# EAGLE schematic display_device (EAGLE 8.3.2)
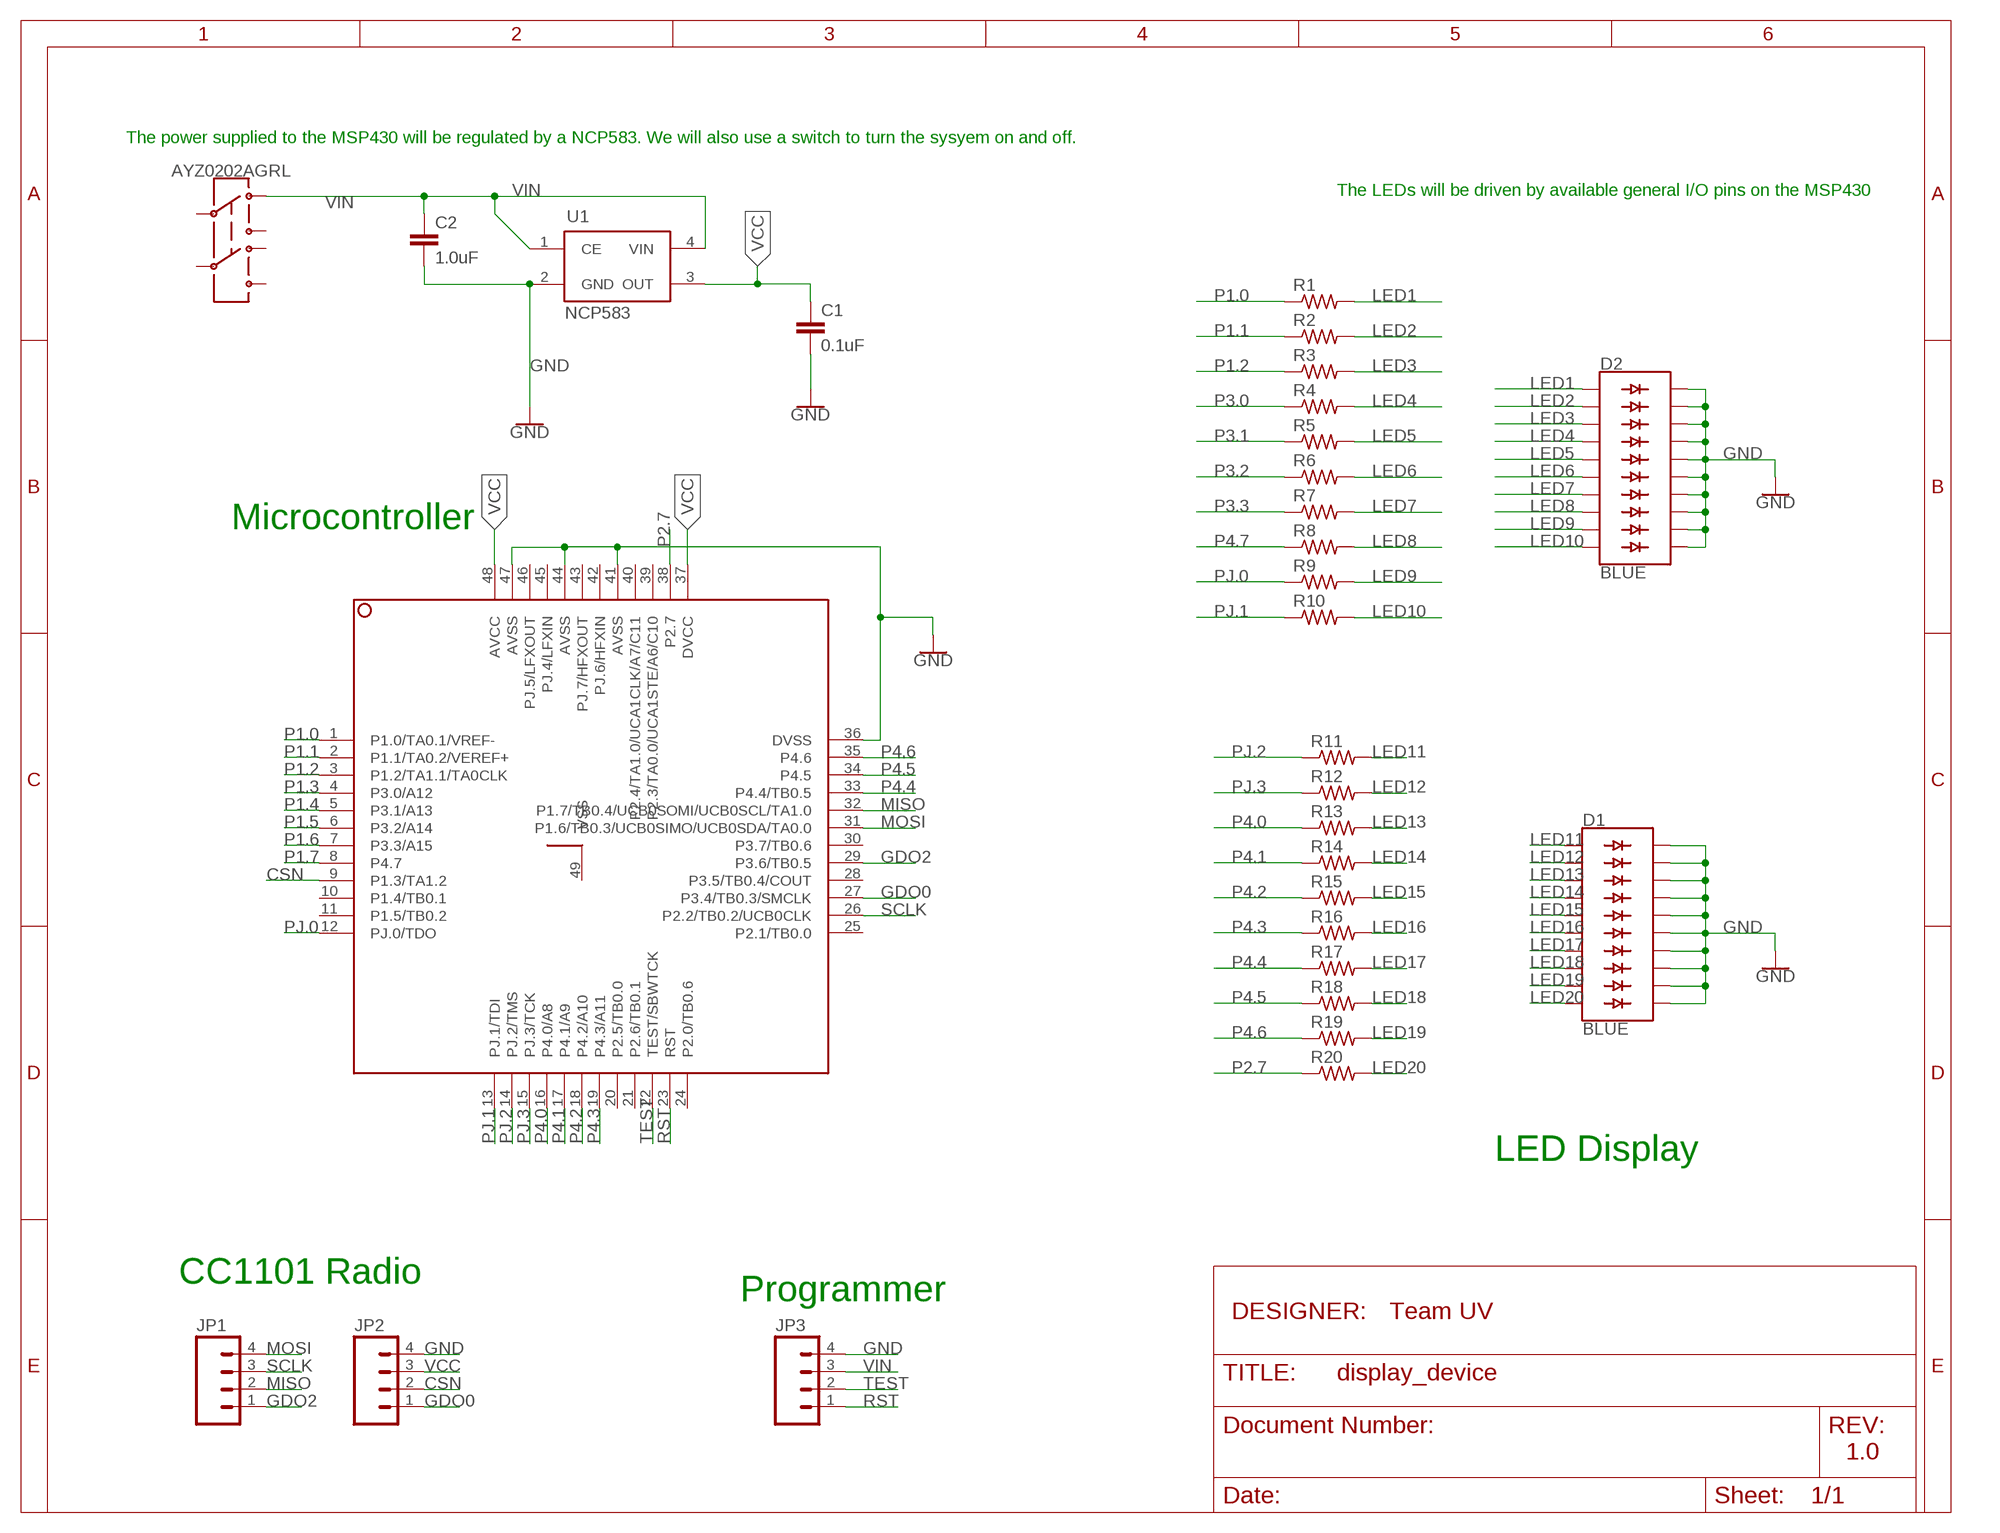
[diagram p0: schematic, sheet 1]

## Parts
AYZ0202AGRL  SWITCH-DPDT-SMD-AYZ0202  [SWITCH_DPDT_SMD_AYZ0202]
C1  0.1uF  1.0UF-0805-25V-(+80/-20%)  [0805]
C2  1.0uF  1.0UF-0805-25V-(+80/-20%)  [0805]
D1  BLUE  LED_BARGRAPH_10BLUE  [LED_BARGRAPH_10]
D2  BLUE  LED_BARGRAPH_10BLUE  [LED_BARGRAPH_10]
JP1  M04PTH  [1X04]
JP2  M04PTH  [1X04]
JP3  M04PTH  [1X04]
R1  R-US_R0805  [R0805]
R2  R-US_R0805  [R0805]
R3  R-US_R0805  [R0805]
R4  R-US_R0805  [R0805]
R5  R-US_R0805  [R0805]
R6  R-US_R0805  [R0805]
R7  R-US_R0805  [R0805]
R8  R-US_R0805  [R0805]
R9  R-US_R0805  [R0805]
R10  R-US_R0805  [R0805]
R11  R-US_R0805  [R0805]
R12  R-US_R0805  [R0805]
R13  R-US_R0805  [R0805]
R14  R-US_R0805  [R0805]
R15  R-US_R0805  [R0805]
R16  R-US_R0805  [R0805]
R17  R-US_R0805  [R0805]
R18  R-US_R0805  [R0805]
R19  R-US_R0805  [R0805]
R20  R-US_R0805  [R0805]
U1  NCP583  [SC82-AB_1PRIMARY]
U2  MSP430FR5969_RGZ_48  [RGZ48_4P1X4P1]

## Nets
CSN: JP2.2 U2.9(P1.3/TA1.2)
GDO0: JP2.1 U2.27(P3.4/TB0.3/SMCLK)
GDO2: JP1.1 U2.29(P3.6/TB0.5)
GND: C1.2 C2.2 D1.11(C9) D1.12(C8) D1.13(C7) D1.14(C6) D1.15(C5) D1.16(C4) D1.17(C3) D1.18(C2) D1.19(C1) D1.20(C) D2.11(C9) D2.12(C8) D2.13(C7) D2.14(C6) D2.15(C5) D2.16(C4) D2.17(C3) D2.18(C2) D2.19(C1) D2.20(C) JP2.4 JP3.4 U1.2(GND) U2.36(DVSS) U2.41(AVSS) U2.44(AVSS) U2.47(AVSS)
LED1: D2.1(A) R1.2
LED2: D2.2(A1) R2.2
LED3: D2.3(A2) R3.2
LED4: D2.4(A3) R4.2
LED5: D2.5(A4) R5.2
LED6: D2.6(A5) R6.2
LED7: D2.7(A6) R7.2
LED8: D2.8(A7) R8.2
LED9: D2.9(A8) R9.2
LED10: D2.10(A9) R10.2
LED11: D1.1(A) R11.2
LED12: D1.2(A1) R12.2
LED13: D1.3(A2) R13.2
LED14: D1.4(A3) R14.2
LED15: D1.5(A4) R15.2
LED16: D1.6(A5) R16.2
LED17: D1.7(A6) R17.2
LED18: D1.8(A7) R18.2
LED19: D1.9(A8) R19.2
LED20: D1.10(A9) R20.2
MISO: JP1.2 U2.32(P1.7/TB0.4/UCB0SOMI/UCB0SCL/TA1.0)
MOSI: JP1.4 U2.31(P1.6/TB0.3/UCB0SIMO/UCB0SDA/TA0.0)
P1.0: R1.1 U2.1(P1.0/TA0.1/VREF-)
P1.1: R2.1 U2.2(P1.1/TA0.2/VEREF+)
P1.2: R3.1 U2.3(P1.2/TA1.1/TA0CLK)
P1.3: U2.4(P3.0/A12)
P1.4: U2.5(P3.1/A13)
P1.5: U2.6(P3.2/A14)
P1.6: U2.7(P3.3/A15)
P1.7: U2.8(P4.7)
P2.7: R20.1 U2.38(P2.7)
P3.0: R4.1
P3.1: R5.1
P3.2: R6.1
P3.3: R7.1
P4.0: R13.1 U2.16(P4.0/A8)
P4.1: R14.1 U2.17(P4.1/A9)
P4.2: R15.1 U2.18(P4.2/A10)
P4.3: R16.1 U2.19(P4.3/A11)
P4.4: R17.1 U2.33(P4.4/TB0.5)
P4.5: R18.1 U2.34(P4.5)
P4.6: R19.1 U2.35(P4.6)
P4.7: R8.1
PJ.0: R9.1 U2.12(PJ.0/TDO)
PJ.1: R10.1 U2.13(PJ.1/TDI)
PJ.2: R11.1 U2.14(PJ.2/TMS)
PJ.3: R12.1 U2.15(PJ.3/TCK)
RST: JP3.1 U2.23(RST)
SCLK: JP1.3 U2.26(P2.2/TB0.2/UCB0CLK)
TEST: JP3.2 U2.22(TEST/SBWTCK)
VCC: C1.1 JP2.3 U1.3(OUT) U2.37(DVCC) U2.48(AVCC)
VIN: AYZ0202AGRL.1 C2.1 JP3.3 U1.1(CE) U1.4(VIN)
Unconnected: AYZ0202AGRL.2 AYZ0202AGRL.3 AYZ0202AGRL.4 AYZ0202AGRL.5 AYZ0202AGRL.6 U2.10(P1.4/TB0.1) U2.11(P1.5/TB0.2) U2.20(P2.5/TB0.0) U2.21(P2.6/TB0.1) U2.24(P2.0/TB0.6) U2.25(P2.1/TB0.0) U2.28(P3.5/TB0.4/COUT) U2.30(P3.7/TB0.6) U2.39(P2.3/TA0.0/UCA1STE/A6/C10) U2.40(P2.4/TA1.0/UCA1CLK/A7/C11) U2.42(PJ.6/HFXIN) U2.43(PJ.7/HFXOUT) U2.45(PJ.4/LFXIN) U2.46(PJ.5/LFXOUT) U2.49(VSS)

## Notes on the sheet
- The power supplied to the MSP430 will be regulated by a NCP583. We will also use a switch to turn the sysyem on and off.
- The LEDs will be driven by available general I/O pins on the MSP430
- Microcontroller
- LED Display
- CC1101 Radio
- Programmer
- DESIGNER: | Team UV
- 1.0

## Library data of the parts
AYZ0202AGRL = SparkFun-Switches:SWITCH-DPDT: Double-Pole, Double-Throw (DPDT) Switch Double-pole, double-throw switches. Variant Overview PTH-GPI-152-3013 Used on SparkFun Geiger Counter <https://www.sparkfun.com/products/11345> SMD-AY0202 Surface Mount DPDT Switch <https://www.sparkfun.com/products/597> (COM-00597) Used on e.g. LilyPad Arduino USB - ATmega32U4 Board <https://www.sparkfun.com/products/12049>; PROD_ID: SWCH-08179; SF_SKU: COM-00597
C1 = SparkFun-Capacitors:1.0UF: 1µF ceramic capacitors A capacitor is a passive two-terminal electrical component used to store electrical energy temporarily in an electric field.; PROD_ID: CAP-11625; VALUE: 1.0uF
C2 = SparkFun-Capacitors:1.0UF: 1µF ceramic capacitors A capacitor is a passive two-terminal electrical component used to store electrical energy temporarily in an electric field.; PROD_ID: CAP-11625
D1 D2 = SparkFun-LED:LED_BARGRAPH_10: Young Sun LED Tech - YSLB-10251G5-10 10-Segment LED Bar Graph Features: Red Vf = 2.1V, Ifmax = 20mA Yellow Vf = 2.1V, Ifmax = 20mA Blue Vf = 3.4V, Ifmax = 20mA Green Vf = 3.4V, Ifmax = 20mA SparkFun Products: Red <https://www.sparkfun.com/products/9935> Yellow <https://www.sparkfun.com/products/9936> Green <https://www.sparkfun.com/products/9938> Blue <https://www.sparkfun.com/products/9937>; PROD_ID: DIO-10613
JP1-JP3 = Moo1.2:M04: Header 4 Standard 4-pin 0.1" header. Use with straight break away headers (SKU : PRT-00116), right angle break away headers (PRT-00553), swiss pins (PRT-00743), machine pins (PRT-00117), and female headers (PRT-00115). Molex polarized connector foot print use with SKU : PRT-08231 with associated crimp pins and housings. 1MM SMD Version SKU: PRT-10208
R1-R20 = rcl:R-US_: RESISTOR, American symbol
U1 = ncp583:NCP583: NCP583 - Ultra-Low Iq 150 mA CMOS LDO Regulator with Enable The NCP583 series of low dropout regulators are designed for portable battery powered applications which require precise output voltage accuracy and low quiescent current. These devices feature an enable function which lowers current consumption significantly and are offered in two small packages; SC−82AB and the SOT−563. A 1.0 mF ceramic capacitor is the recommended value to be used with these devices on the output pin.
U2 = msp430:MSP430FR5969_RGZ_48: MSP430FR59xx Mixed Signal Microcontroller Package: RGZ-S-PQVFN-N48 (MSP430FR596x and MSP430FR586x) Description The Texas Instruments MSP430FR58xx and MSP430FR59xx family of ultralow-power microcontrollers consists of several devices featuring embedded FRAM nonvolatile memory, an ultralow-power 16-bit MSP430 CPU, and different sets of peripherals targeted for various applications. The architecture, FRAM, and peripherals, combined with seven low-power modes, are optimized to achieve extended battery life in portable and wireless sensing applications. FRAM is a new nonvolatile memory that combines the speed, flexibility, and endurance of SRAM with the stability and reliability of flash, all at lower total power consumption.; MANUFACTURER_PART_NUMBER: msp430fr5969_rgz_48; VENDOR: Texas Instruments